# EasyEDA Pro project USB_HUB.epro

# Schematic Schematic1
Board Name: Board1; Create Date: 2026-06-12; Page Name: P1; Project Name: New Project_2026-06-12_17-28-49; Schematic Name: Schematic1; Update Date: 2026-06-12; Company: EasyEDA.com; Page Size: A4; Version: V1.0
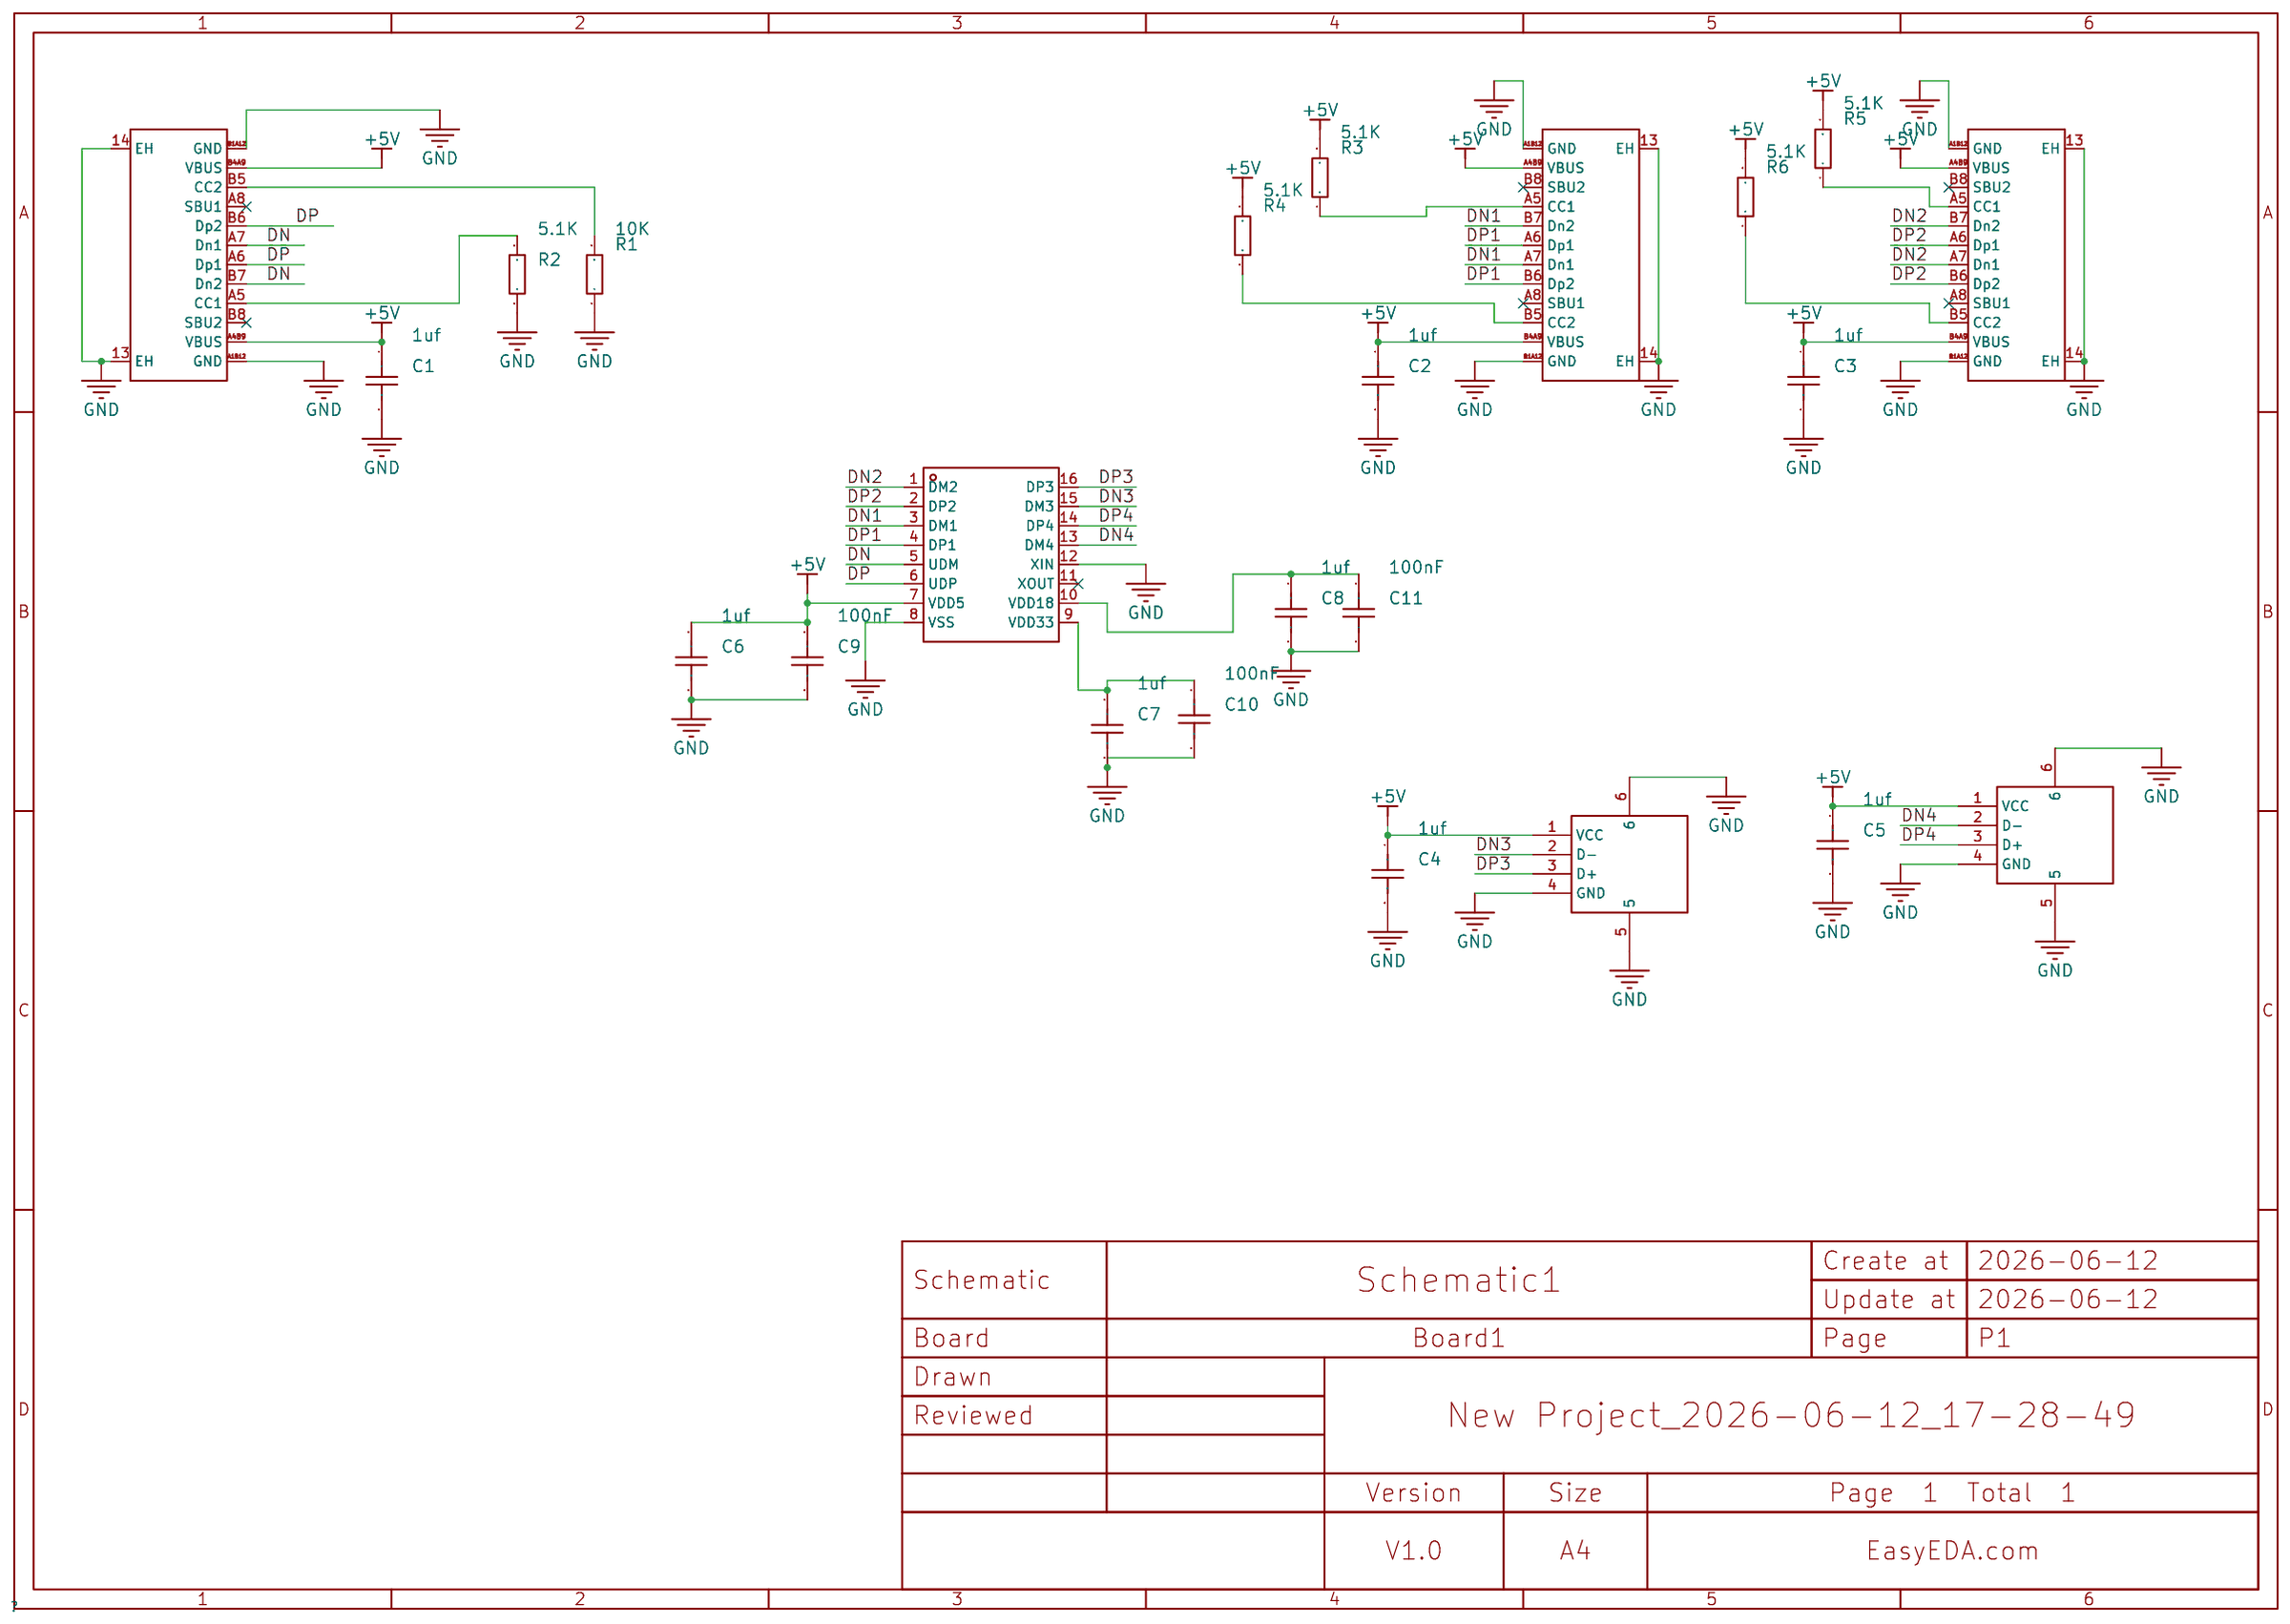
[diagram p0: schematic sheet]

## Parts
C1  1uf  [C0603]
C2  1uf  [C0603]
C3  1uf  [C0603]
C4  1uf  [C0603]
C5  1uf  [C0603]
C6  1uf  [C0603]
C7  1uf  [C0603]
C8  1uf  [C0603]
C9  100nF  [C0603]
C10  100nF  [C0603]
C11  100nF  [C0603]
R1  10K  [R0603]
R2  5.1K  [R0603]
R3  5.1K  [R0603]
R4  5.1K  [R0603]
R5  5.1K  [R0603]
R6  5.1K  [R0603]
U1  SL2.1s  [SSOP-16_L4.6-W2.6-P0.53-LS4.0-BL]
USB1  TYPE-C 16PIN 2MD(073)  [USB-C-SMD_TYPE-C-16PIN-2MD-073]
USB2  TYPE-C 16PIN 2MD(073)  [USB-C-SMD_TYPE-C-16PIN-2MD-073]
USB3  10.0 QHHTZB6.3  [USB-A-TH_10.0QHHTZB6.3]
USB4  10.0 QHHTZB6.3  [USB-A-TH_10.0QHHTZB6.3]
USB5  TYPE-C 16PIN 2MD(073)  [USB-C-SMD_TYPE-C-16PIN-2MD-073]

## Library data of the parts
C1-C11 = CAP_0603: Supplier Footprint: 0603
R1-R6 = Res_0603: Supplier Footprint: 0603
U1 = SL2.1s: type:Hub USB Protocol:USB 2.0 Data Rate:- Voltage - Supply:4V~5.25V Voltage - Supply:4V~5.25V Operating Temperature:0℃~+70℃ Operating Temperature:0℃~+70℃ Memory Interface:- Current - Supply:120mA Quiescent Supply Current:2.5mA Number of Channels:4; LCSC Part Name: USB2.0 HUB控制器集成电路; Supplier Part: C2684433; Manufacturer: CoreChips(和芯润德); Supplier Footprint: SSOP-16; JLCPCB Part Class: Extended Part; Datasheet: https://item.szlcsc.com/datasheet/SL2.1s/2782346.html; Supplier: LCSC; type: Hub; USB Protocol: USB 2.0; Voltage - Supply: 4V~5.25V; Operating Temperature: 0℃~+70℃; Current - Supply: 120mA; Quiescent Supply Current: 2.5mA; Number of Channels: 4
USB1 USB2 USB5 = TYPE-C 16PIN 2MD(073): Connector Type:Type-C Protocol Standard:- Gender:Female Mounting Type:Surface Mount, Right Angle Number of Contacts:16P Number of Ports:1 Current Rating-Power:3A Voltage Rating:5V Connect-Disconnect Life:10,000 Cycles Supplementary Features:- Center Heigh; LCSC Part Name: Type-C 母 卧贴; Supplier Part: C2765186; Manufacturer: SHOU HAN(首韩); Supplier Footprint: SMD; JLCPCB Part Class: Extended Part; Datasheet: https://item.szlcsc.com/datasheet/TYPE-C%252016PIN%25202MD(073)/2901843.html; Supplier: LCSC; Connector Type: Type-C; Gender: Female; Mounting Type: Surface Mount, Right Angle; Number of Contacts: 16P; Number of Ports: 1; Current Rating-Power: 3A; Voltage Rating: 5V; Connect-Disconnect Life: 10,000 Cycles; Detection color: Black; Operating Temperature: -25℃~+85℃
USB3 USB4 = 10.0 QHHTZB6.3: Connector Type:Type-A Protocol Standard:USB 2.0 Gender:Female Mounting Type:Surface Mount, Right Angle Number of Contacts:4P Number of Ports:1 Current Rating-Power:1.5A Voltage Rating:30V Connect-Disconnect Life:5,000 times Supplementary Features:- Center; LCSC Part Name: 壳长10.0mm; Supplier Part: C668591; Manufacturer: SHOU HAN(首韩); Supplier Footprint: SMD; JLCPCB Part Class: Extended Part; Datasheet: https://item.szlcsc.com/datasheet/10.0%2520QHHTZB6.3/698534.html; Supplier: LCSC; Connector Type: Type-A; Protocol Standard: USB 2.0; Gender: Female; Mounting Type: Surface Mount, Right Angle; Number of Contacts: 4P; Number of Ports: 1; Current Rating-Power: 1.5A; Voltage Rating: 30V; Connect-Disconnect Life: 5,000 times; Length: 10mm; Detection color: Black; Operating Temperature: -25℃~+85℃

## Nets
+5V: C1.1 C2.1 C3.1 C4.1 C5.1 C6.1 C9.1 R3.2 R4.2 R5.2 R6.2 U1.7(VDD5) USB1.A4B9(VBUS) USB1.B4A9(VBUS) USB2.A4B9(VBUS) USB2.B4A9(VBUS) USB3.1(VCC) USB4.1(VCC) USB5.A4B9(VBUS) USB5.B4A9(VBUS)
GND: C1.2 C2.2 C3.2 C4.2 C5.2 C6.2 C7.2 C8.2 C9.2 C10.2 C11.2 R1.1 R2.1 U1.8(VSS) U1.12(XIN) USB1.13(EH) USB1.14(EH) USB1.A1B12(GND) USB1.B1A12(GND) USB2.13(EH) USB2.14(EH) USB2.A1B12(GND) USB2.B1A12(GND) USB3.4(GND) USB3.5 USB3.6 USB4.4(GND) USB4.5 USB4.6 USB5.13(EH) USB5.14(EH) USB5.A1B12(GND) USB5.B1A12(GND)
DN: U1.5(UDM) USB5.A7(Dn1) USB5.B7(Dn2)
DN1: U1.3(DM1) USB1.A7(Dn1) USB1.B7(Dn2)
DN2: U1.1(DM2) USB2.A7(Dn1) USB2.B7(Dn2)
DN3: U1.15(DM3) USB3.2(D-)
DN4: U1.13(DM4) USB4.2(D-)
DP: U1.6(UDP) USB5.A6(Dp1) USB5.B6(Dp2)
DP1: U1.4(DP1) USB1.A6(Dp1) USB1.B6(Dp2)
DP2: U1.2(DP2) USB2.A6(Dp1) USB2.B6(Dp2)
DP3: U1.16(DP3) USB3.3(D+)
DP4: U1.14(DP4) USB4.3(D+)
$1N6: R2.2 USB5.A5(CC1)
$1N7: R1.2 USB5.B5(CC2)
$1N60: R3.1 USB1.A5(CC1)
$1N61: R4.1 USB1.B5(CC2)
$1N64: R6.1 USB2.B5(CC2)
$1N65: R5.1 USB2.A5(CC1)
$1N77: C7.1 C10.1 U1.9(VDD33)
$1N79: C8.1 C11.1 U1.10(VDD18)

Not connected (* = marked no-connect by the designer): U1 11(XOUT)*; USB1 A8(SBU1)* B8(SBU2)*; USB2 A8(SBU1)* B8(SBU2)*; USB5 A8(SBU1)* B8(SBU2)*

# Board PCB1
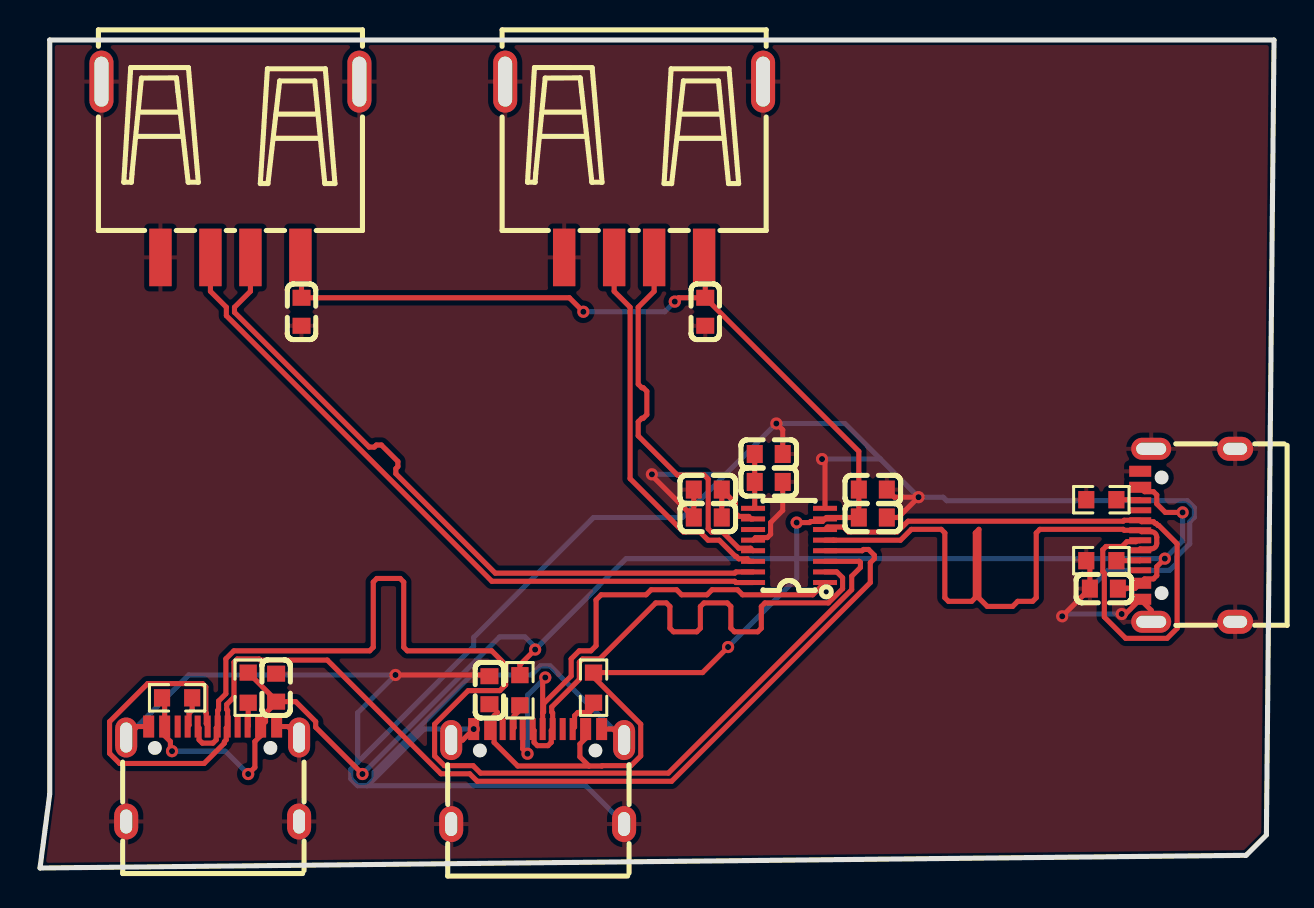
[diagram p1: board, top side]
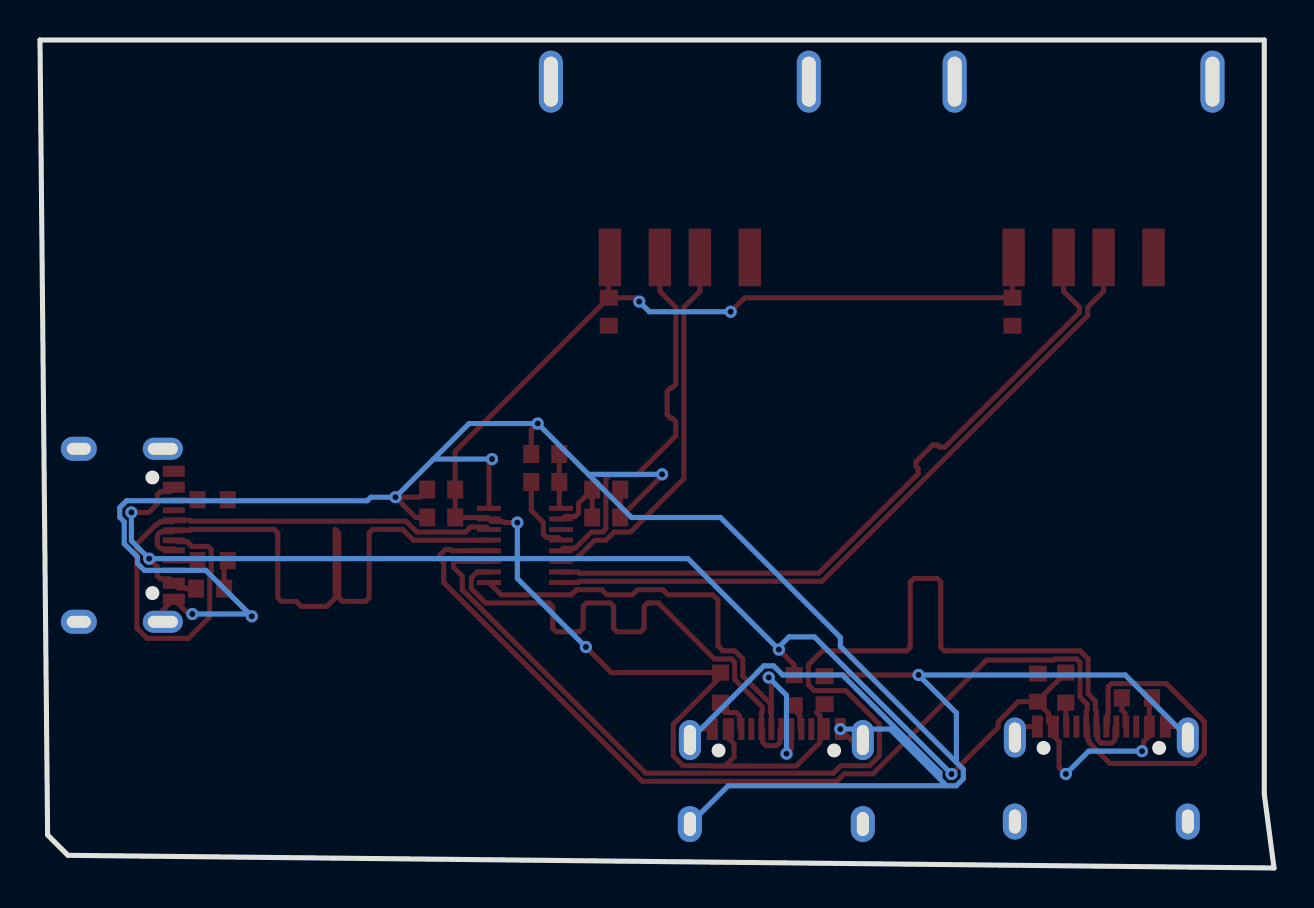
[diagram p2: board, bottom side, seen from below]

Outline 61.72 x 41.4 mm; copper layers: Top Layer, Bottom Layer. Coordinates in mm from the lower left corner of the outline.
Outline path: 0,0 0.49,3.69 0.49,41.4 61.72,41.4 61.34,1.65 60.32,0.64 0,0
Stack: Top Layer 0.035mm / Dielectric1 1.51mm FR4 er 4.5 / Bottom Layer 0.035mm

## Design rules (mm)
net DN2: DP1
net DP2: DP1
net DN1: DP2
net DP1: DP2
net DN: D
net DP: D
net DN4: DP4
net DP4: DP4
net DN3: DP3
net DP3: DP3
spacing copperThickness1oz (default): track to track 0.102, other pairs 0.152 to 0.3
spacing copperThickness2oz: track to track 0.203, other pairs 0.152 to 0.3
track width copperThickness1oz (default): min 0.127, default 0.254, max 2.54
track width copperThickness2oz: min 0.203, default 0.254, max 2.54
differential pair differentialPair (default): width min 0.127, default 0.254, max 2.54; gap min 0.152, default 0.152
net GND uses copperRegion

## Placement (name value [footprint] x y rotation side)
C1  1uf  [C0603]  53.21 13.97 180 top
C2  1uf  [C0603]  11.81 9.02 90 top
C3  1uf  [C0603]  22.48 8.89 90 top
C4  1uf  [C0603]  13.08 27.81 270 top
C5  1uf  [C0603]  33.27 27.81 270 top
C6  1uf  [C0603]  41.66 18.92 0 top
C7  1uf  [C0603]  36.45 20.7 0 top
C8  1uf  [C0603]  33.4 18.92 180 top
C9  100nF  [C0603]  41.66 17.53 0 top
C10  100nF  [C0603]  36.45 19.3 0 top
C11  100nF  [C0603]  33.4 17.53 180 top
R1  10K  [R0603]  53.09 18.41 0 top
R2  5.1K  [R0603]  53.09 15.37 0 top
R3  5.1K  [R0603]  6.86 8.51 180 top
R4  5.1K  [R0603]  10.41 9.02 90 top
R5  5.1K  [R0603]  24 8.89 90 top
R6  5.1K  [R0603]  27.69 9.02 90 top
U1  SL2.1s  [SSOP-16_L4.6-W2.6-P0.53-LS4.0-BL]  37.47 16.13 90 top
USB1  TYPE-C 16PIN 2MD(073)  [USB-C-SMD_TYPE-C-16PIN-2MD-073]  8.64 4.7 0 top
USB2  TYPE-C 16PIN 2MD(073)  [USB-C-SMD_TYPE-C-16PIN-2MD-073]  24.89 4.57 0 top
USB3  10.0 QHHTZB6.3  [USB-A-TH_10.0QHHTZB6.3]  9.53 34.92 180 top
USB4  10.0 QHHTZB6.3  [USB-A-TH_10.0QHHTZB6.3]  29.72 34.92 180 top
USB5  TYPE-C 16PIN 2MD(073)  [USB-C-SMD_TYPE-C-16PIN-2MD-073]  57.4 16.64 90 top

## Footprints (pads in the part's own frame, mm; a bottom-side part is the same pattern mirrored in y, then rotated)
C0603
  rect 0.8x0.9 smd: 1(-0.7,0) 2(0.7,0)
R0603
  rect 0.806x0.864 smd: 1(-0.753,0) 2(0.753,0)
SSOP-16_L4.6-W2.6-P0.53-LS4.0-BL
  rect 0.25x1.2 smd: 1(-1.855,-1.8) 2(-1.325,-1.8) 3(-0.795,-1.8) 4(-0.265,-1.8) 5(0.265,-1.8) 6(0.795,-1.8) 7(1.325,-1.8) 8(1.855,-1.8) 9(1.855,1.8) 10(1.325,1.8) 11(0.795,1.8) 12(0.265,1.8) 13(-0.265,1.8) 14(-0.795,1.8) 15(-1.325,1.8) 16(-1.855,1.8)
USB-A-TH_10.0QHHTZB6.3
  rect 1.12x2.88 smd: 1(-3.5,4.395) 2(-1,4.395) 3(1,4.395) 4(3.5,4.395)
  oval 1.2x3.1 hole 0.7x2.5: 5(-6.45,-4.395) 6(6.45,-4.395)
USB-C-SMD_TYPE-C-16PIN-2MD-073
  oval 1.1x2 hole 0.6x1.5: 13(-4.325,1.825) 14(4.325,1.825)
  oval 1.2x1.8 hole 0.6x1.2: 13(-4.325,-2.375) 14(4.325,-2.375)
  rect 0.55x1.1 smd: A1B12(-3.2,2.375) A4B9(-2.4,2.375) B1A12(3.2,2.375) B4A9(2.4,2.375)
  rect 0.3x1.1 smd: A5(-1.25,2.375) A6(-0.25,2.375) A7(0.25,2.375) A8(1.25,2.375) B5(1.75,2.375) B6(0.75,2.375) B7(-0.75,2.375) B8(-1.75,2.375)

## Nets
As in the schematic.

Pads without a net: U1 11; USB1 A8 B8; USB2 A8 B8; USB5 A8 B8

## Via types
v1: diameter 0.61, hole 0.305, Top Layer to Bottom Layer, 20 vias

## Routing (per net, layer and track width the routed paths; a pad name or vN(x,y) marks a point on that pad's centre or on a via; arc(x,y) is an arc through that point)
+5V: length 149
  Top Layer w0.254: C1.1 54.34,13.97 54.36,13.99 54.78,13.99 USB5.A4B9 55.25,14.46 55.69,14.46 55.86,14.62 55.86,15.07 v1(56.26,15.47) ; v1(37.85,17.27) 38.49,17.27 38.55,17.33 39.14,17.33 39.34,17.53 C9.1 C6.1 40.96,20.83 C5.1 ; R5.2 24,10.16 v1(24.76,10.92) ; USB2.B4A9 27.29,6.49 27,6.2 27,5.55 27.46,5.1 ; v1(6.6,5.84) 6.52,5.92 6.52,6.33 6.24,6.61 USB1.A4B9 6.24,8.38 R3.2 ; C2.1 11.81,8.37 R4.2 ; C2.1 11.81,8.27 11.28,7.74 11.28,7.32 USB1.B4A9 11.04,6.61 10.75,6.33 10.75,5.03 v1(10.41,4.7) ; C2.1 12.79,8.32 13.79,7.32 13.79,7.04 v1(16.13,4.7) ; 27.46,5.1 23.89,5.1 22.71,6.28 22.71,7.61 22.88,7.78 ; 27.46,5.1 28.1,5.1 28.12,5.12 29.56,5.12 30.05,5.6 30.05,7.19 27.69,9.55 R6.2 33.14,9.77 v1(34.42,11.05) ; v1(57.15,17.78) 56.29,17.78 55.86,18.21 55.86,18.65 55.69,18.82 55.25,18.82 USB5.B4A9 ; v1(27.18,27.81) 26.48,28.51 C4.1 13.08,30.47 USB3.1 ; v1(31.75,28.32) 31.94,28.51 C5.1 ; C5.1 33.27,30.47 USB4.1
  Bottom Layer w0.254: v1(27.18,27.81) 31.24,27.81 v1(31.75,28.32) ; 37.85,15.47 37.85,14.48 v1(34.42,11.05) ; 37.85,15.47 29.31,15.47 v1(24.76,10.92) 24.76,11.05 24.26,11.56 22.99,11.56 v1(16.13,4.7) ; 37.85,15.47 v1(56.26,15.47) 57.15,16.36 v1(57.15,17.78) ; 37.85,15.47 v1(37.85,17.27) ; v1(6.6,5.84) 9.27,5.84 v1(10.41,4.7)
GND: length 161.2
  Top Layer w0.254: USB2.14 28.67,6.95 USB2.B1A12 ; v1(39.12,20.45) 39.26,20.3 39.26,17.98 ; v1(17.78,9.65) 22.42,9.65 C3.2 ; v1(30.61,19.69) 30.61,19.62 32.7,17.53 32.7,18.92 ; 12.96,6.52 12.41,7.07 USB1.B1A12 ; C7.2 37.15,21.91 v1(36.83,22.22) ; USB2.13 21.14,6.4 v1(21.69,6.95) ; v1(51.13,12.59) C1.2 52.51,15.19 R2.1 ; v1(54.1,12.7) 54.29,12.7 USB5.A1B12 55.58,12.89 USB5.13 ; U1.12 35.79,16.52 36.38,16.52 36.54,16.68 36.54,17.27 37.15,17.88 C10.2 ; C6.2 42.74,18.54 v1(43.94,18.54) 42.93,17.53 C9.2 ; USB1.13 4.86,7.07 USB1.A1B12
  Bottom Layer w0.254: 15.89,5.28 21.69,11.09 21.69,11.53 27.69,17.53 32.13,17.53 34.29,19.69 ; 15.89,5.28 15.54,4.94 15.54,4.46 15.89,4.11 16.37,4.11 ; 15.89,5.28 15.89,7.76 v1(17.78,9.65) 7.44,9.65 USB1.13 ; 16.37,4.11 27.3,4.11 USB2.14 ; 16.37,4.11 16.71,4.46 ; 16.71,4.46 16.71,4.78 21.59,9.65 24.57,9.65 25.03,10.11 25.51,10.11 25.86,9.77 25.86,9.76 USB2.14 ; 16.71,4.46 19.2,6.95 v1(21.69,6.95) ; 51.24,12.7 v1(51.13,12.59) ; 51.24,12.7 53.43,14.89 56.5,14.89 56.84,15.23 56.84,15.55 57.51,16.21 57.51,17.31 57.73,17.54 57.73,18.02 57.39,18.36 45.35,18.36 45.17,18.54 v1(43.94,18.54) 42.04,20.45 ; 51.24,12.7 v1(54.1,12.7) ; v1(39.12,20.45) 42.04,20.45 ; 42.04,20.45 40.26,22.22 v1(36.83,22.22) 34.29,19.69 ; 34.29,19.69 v1(30.61,19.69)
DN: length 32.3
  Top Layer w0.254: 39.26,16.39 39.69,16.39 39.69,16.39 43.04,16.39 43.58,16.93 45.08,16.93 45.26,16.75 45.26,13.51 45.44,13.33 46.6,13.33 46.78,13.51 46.78,16.75 46.96,16.93 46.96,13.5 47.38,13.08 48.65,13.08 48.9,13.33 49.65,13.33 49.83,13.51 49.83,16.75 50.01,16.93 54.18,16.93 54.22,16.89 USB5.A7 55.1,16.82 55.58,16.82 arc(55.78,16.73) 55.86,16.54 55.86,16.24 arc(55.78,16.04) 55.58,15.96 55.03,15.96 USB5.B7
DN1: length 62.5
  Top Layer w0.254: USB1.B7 7.96,7 7.96,6.41 8.12,6.25 8.65,6.25 8.81,6.41 8.81,7 USB1.A7 8.89,7.88 8.93,7.92 8.93,8.35 9.3,8.71 9.3,10.46 9.7,10.86 16.49,10.86 16.67,11.04 16.67,14.3 16.85,14.48 18.01,14.48 18.19,14.3 18.19,11.04 18.37,10.86 22.59,10.86 23.29,10.16 23.29,9.16 23,8.87 21.42,8.87 19.74,7.19 19.74,5.6 20.22,5.12 21.66,5.12 22.04,4.74 31.43,4.74 40.6,13.92 40.6,14.59 41.04,15.03 41.04,15.28 40.98,15.33 39.26,15.33
DN2: length 27.5
  Top Layer w0.254: v1(25.27,9.53) 25.14,9.39 25.14,7.75 ; 25.14,7.75 USB2.A7 ; 25.14,7.75 25.19,7.8 25.19,8.22 26.57,9.6 26.57,10.46 26.97,10.86 27.56,10.86 27.81,11.11 27.81,13.41 28.07,13.66 30.31,13.66 30.57,13.91 31.84,13.91 32.09,13.66 33.36,13.66 33.62,13.91 34.89,13.91 35.14,13.66 38.65,13.66 39.26,14.27 ; v1(24.38,5.72) 24.14,5.96 USB2.B7
  Bottom Layer w0.254: v1(24.38,5.72) 24.38,8.64 v1(25.27,9.53)
DN3: length 35
  Top Layer w0.254: U1.15 34.81,14.8 34.75,14.74 22.77,14.74 17.8,19.72 17.8,19.97 17.9,20.07 17.9,20.33 17.08,21.15 16.82,21.15 16.72,21.05 16.47,21.05 9.73,27.78 9.73,28.04 10.53,28.84 USB3.2
DN4: length 19.3
  Top Layer w0.254: USB4.2 30.72,28.84 29.92,28.04 29.92,24.19 30.1,24.01 30.17,24.01 30.35,23.83 30.35,22.67 30.17,22.49 30.1,22.49 29.92,22.31 29.92,21.61 31.88,19.65 33.22,19.65 33.42,19.45 33.42,16.96 33.59,16.8 34.14,16.8 34.95,15.99 35.54,15.99 U1.13
DP: length 32.5
  Top Layer w0.254: 39.26,16.92 39.39,17.05 40.19,17.05 40.44,16.8 42.87,16.8 43.41,17.34 54.18,17.34 54.22,17.39 USB5.B6 55.1,17.32 55.69,17.32 55.79,17.22 55.83,17.22 55.92,17.13 55.95,17.13 56.88,16.21 56.88,11.99 56.37,11.48 54.3,11.48 53.23,12.55 53.23,14.74 53.16,14.82 53.16,15.91 53.32,16.08 54.13,16.08 54.36,16.32 54.81,16.32 54.86,16.36 55.01,16.36 USB5.A6
DP1: length 62.5
  Top Layer w0.254: USB1.A6 8.39,7.15 8.31,7.22 8.31,7.74 8.29,7.76 8.29,9.06 8.13,9.22 5.38,9.22 3.48,7.32 3.48,5.73 3.99,5.23 8.21,5.23 9.22,6.24 9.22,6.31 9.31,6.41 9.31,7 USB1.B6 9.39,7.88 9.34,7.92 9.34,8.18 9.7,8.54 9.7,10.29 9.87,10.45 10.96,10.45 11.02,10.4 14.37,10.4 20.06,4.71 21.49,4.71 21.87,4.34 31.59,4.34 41.53,14.27 41.53,15.27 41.73,15.47 41.73,15.64 41.44,15.93 41.19,15.93 41.12,15.86 39.26,15.86
DP2: length 27.5
  Top Layer w0.254: 39.26,14.8 39.85,14.8 40.14,14.51 40.14,13.97 39.43,13.25 36.26,13.25 36.08,13.08 36.08,11.99 35.9,11.81 34.73,11.81 34.55,11.99 34.55,13.08 34.38,13.25 33.21,13.25 33.03,13.08 33.03,11.99 32.85,11.81 31.69,11.81 31.51,11.99 31.51,13.08 31.33,13.25 30.8,13.25 28,10.45 27.14,10.45 26.97,10.29 26.97,9.43 25.59,8.05 25.59,7.8 25.64,7.75 USB2.B6 25.57,6.88 25.57,6.28 25.41,6.12 24.88,6.12 24.71,6.28 24.71,6.88 USB2.A6
DP3: length 35.1
  Top Layer w0.254: USB3.3 8.53,28.84 9.32,28.04 9.32,27.62 22.6,14.34 34.75,14.34 34.81,14.27 U1.16
DP4: length 19.3
  Top Layer w0.254: USB4.3 28.72,28.84 29.51,28.04 29.51,19.47 32.19,16.8 33.01,16.8 33.42,16.39 33.97,16.39 34.78,15.58 34.83,15.58 34.95,15.46 35.37,15.46 35.5,15.33 U1.14
$1N6: length 1.2
  Top Layer w0.254: R2.2 55.01,15.37 USB5.A5
$1N7: length 1.2
  Top Layer w0.254: USB5.B5 55,18.41 R1.2
$1N60: length 1.5
  Top Layer w0.254: R3.1 7.61,7.89 7.46,7.74 7.46,7.14 USB1.A5
$1N61: length 1.2
  Top Layer w0.254: USB1.B5 10.41,7.1 R4.1
$1N64: length 2.1
  Top Layer w0.254: USB2.B5 26.74,7.04 26.74,7.61 26.9,7.78 27.47,7.78 27.69,7.99 R6.1
$1N65: length 1.3
  Top Layer w0.254: R5.1 24,7.9 23.71,7.61 23.71,7.02 USB2.A5
$1N77: length 2.8
  Top Layer w0.254: 35.75,20.7 35.75,18.07 U1.9
$1N79: length 3.9
  Top Layer w0.254: C11.1 C8.1 34.79,18.24 34.79,17.74 34.95,17.58 35.44,17.58 35.57,17.45 U1.10

## Copper pours and planes (outline as drawn; the poured copper is in the pictures)
GND on Top Layer: -7.37,53.21 59.44,53.21 72.39,40.26 72.39,0.13 68.58,-3.68 -9.78,-3.68 -10.92,-2.54 -10.92,49.66
